# EAGLE design 0.2 (EAGLE 6.4)
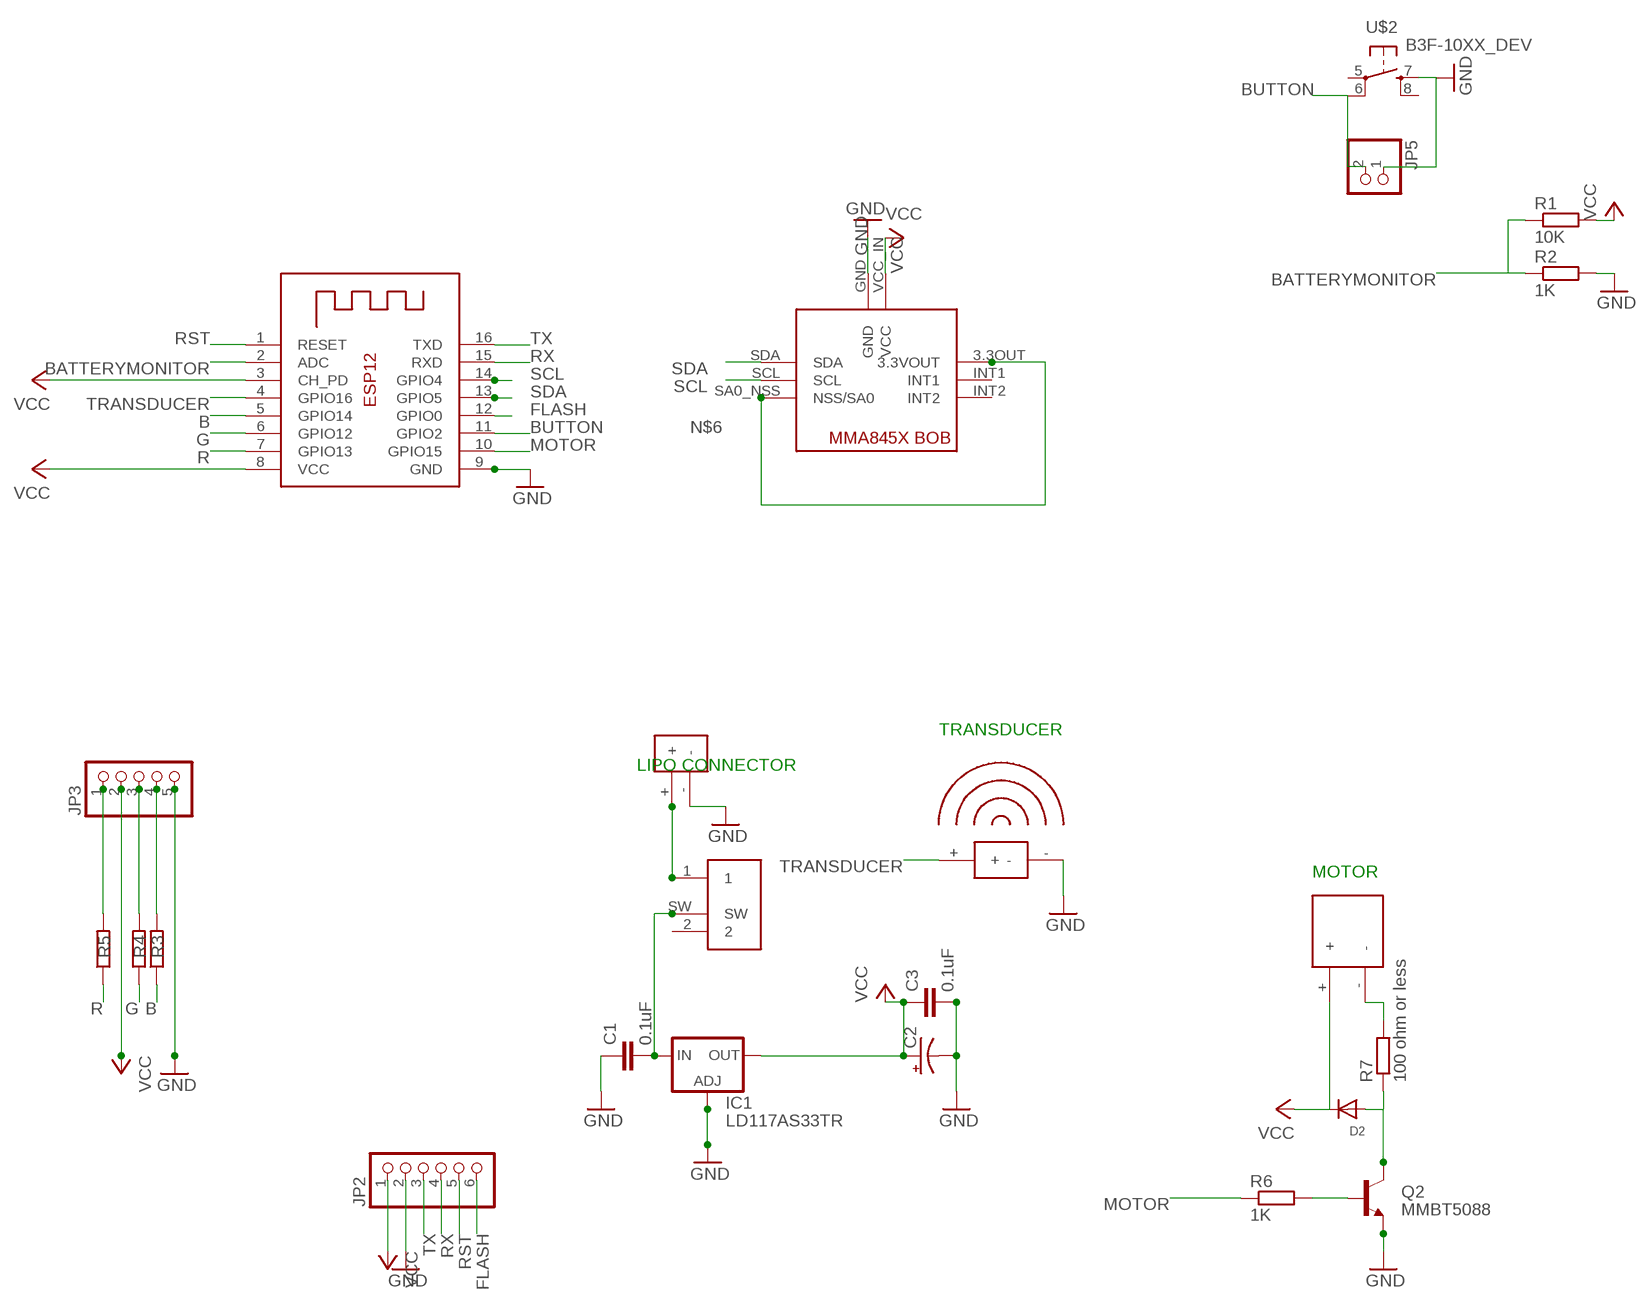
[diagram p0: schematic, sheet 1]

## Parts
C1  0.1uF  CAP0805  [0805]
C2  100UF-25V-20%(PTH)  [CPOL-RADIAL-100UF-25V]
C3  0.1uF  CAP0805  [0805]
D2  DIODE_SOD-123FL  [SOD-123FL]
IC1  LD117AS33TR  [SOT223]
JP2  PINHD-1X6  [1X06]
JP3  PINHD-1X5  [1X05]
JP5  PINHD-1X2/90  [1X02/90]
Q2  MMBT5088  TRANSISTOR_NPNMMBT5088  [SOT23-3]
R1  10K  R-EU_R0805  [R0805]
R2  1K  R-EU_R0805  [R0805]
R3  1K  R-EU_R0805  [R0805]
R4  1K  R-EU_R0805  [R0805]
R5  1K  R-EU_R0805  [R0805]
R6  1K  R-EU_R0805  [R0805]
R7  100 ohm or less  R-EU_R0805  [R0805]
U$1  MMA845X_BREAKOUT  [MMA845XBOB]
U$2  B3F-10XX_DEV  [B3F-10XX]
U$8  TRANSDUCER  [BMT1205XH7.5]
U$11  MICROSWITCH  [MICR_SCHIEBESCHALTER_CHINA_PAC]
U$12  VIBROMOTOR  [VIBRO]
U$13  LIPO  [LIPOCON]
X2  ESP-12  [ESP-12]

## Nets
B: R3.1 X2.5(GPIO14)
BATTERYMONITOR: R1.1 R2.1 X2.2(ADC)
BUTTON: JP5.2 U$2.6(P1) X2.11(GPIO2)
FLASH: JP2.6 X2.12(GPIO0)
G: R4.1 X2.6(GPIO12)
GND: C1.1 C2.2(-) C3.2 IC1.1(ADJ) JP2.2 JP3.5 JP5.1 Q2.2(E) R2.2 U$1.GND U$2.7(S) U$8.- U$13.- X2.9(GND)
MOTOR: R6.1 X2.10(GPIO15)
N$1: R7.2 U$12.-
N$2: U$11.1 U$13.+
N$3: D2.A Q2.3(C) R7.1
N$4: Q2.1(B) R6.2
N$5: C1.2 IC1.3(IN) U$11.SW
N$6: U$1.3.3OUT(3.3VOUT) U$1.SA0_NSS(NSS/SA0)
R: R5.1 X2.7(GPIO13)
RST: JP2.5 X2.1(RESET)
RX: JP2.4 X2.15(RXD)
SCL: U$1.SCL X2.14(GPIO4)
SDA: U$1.SDA X2.13(GPIO5)
TRANSDUCER: U$8.+ X2.4(GPIO16)
TX: JP2.3 X2.16(TXD)
VCC: C2.1(+) C3.1 D2.C IC1.4(OUT) JP2.1 JP3.2 R1.2 U$1.VCC_IN(VCC) U$12.+ X2.3(CH_PD) X2.8(VCC)
XX: JP3.1 R5.2
XXX: JP3.3 R4.2
XXXX: JP3.4 R3.2
Unconnected: U$1.INT1 U$1.INT2 U$2.5(P) U$2.8(S1) U$11.2

## Notes on the sheet
- TRANSDUCER
- LIPO CONNECTOR
- MOTOR

## Library data of the parts
C1 C3 = SparkFun-Passives:CAP: Capacitor Standard 0603 ceramic capacitor, and 0.1" leaded capacitor.
C2 = SparkFun-Capacitors:100UF-25V-20%(PTH): CAP-08439; PROD_ID: CAP-08439
D2 = adafruit:DIODE: Diode SMADIODE - SMA Surface Mount Package 20V 1A Schottky Diode Digikey: 641-1014-6-ND DO-1N4148 - Through Hole Small Current Diode SOD-123 20V 1 A (.5mV Vf) Schottky Diode - Digikey: MBRX120TPMSCT-ND SOD-323 10V 570mA (.38mV Vf, 3ns) Schottky Diode - Digikey: ZLLS410CT-ND SOD-523 30V 30mA Schottky Diode (RB751S-40TE61) - Digikey: RB751S-40TE61CT-ND SOT23-R/W - SOT23 Package (R = Solder Paste/Reflow Ovens, W = Hand-Soldering) BAT54Film 40V 300mA - Digikey: 497-7162-1-ND
IC1 = v-reg:LD117A?*: Low drop fixed and adjustable positive voltage regulators 1 A Source: http://www.st.com/stonline/products/literature/ds/7194/ld1117axx.pdf
JP2 = pinhead:PINHD-1X6: PIN HEADER
JP3 = pinhead:PINHD-1X5: PIN HEADER
JP5 = pinhead:PINHD-1X2: PIN HEADER
Q2 = SparkFun-DiscreteSemi:TRANSISTOR_NPN: Generic NPN BJT MMBT2222A - TRANS-08049 (SOT-23, 1A 40V) MPSA42 - TRANS-09116 (SOT-23, 500mA 300V) MMBT5088LT1G - TRANS-11160 (SOT-23, 50 mA 30V) BC547 - COM-08928 <http://www.sparkfun.com/products/8928> (TO-92 45V 100mA) (1.Collector 2.Base 3.Emitter) 2N3904 - COM-00521 <http://www.sparkfun.com/products/521> (TO-92 40V 200mA) (1.Emitter 2.Base 3.Collector) P2N2222A - COM-12852 <http://www.sparkfun.com/products/12852> (TO-92 40V 600mA) (1.Collector 2.Base 3.Emitter); PROD_ID: TRANS-11160
R1-R7 = resistor:R-EU_: RESISTOR, European symbol
U$1 = roust:MMA845X_BREAKOUT
U$2 = timemachine:B3F-10XX_DEV
U$8 = ghoust:TRANSDUCER
U$11 = roust:MICROSWITCH
U$12 = ghoust:VIBROMOTOR
U$13 = roust:LIPO
X2 = adafruit:ESP-12

## Board
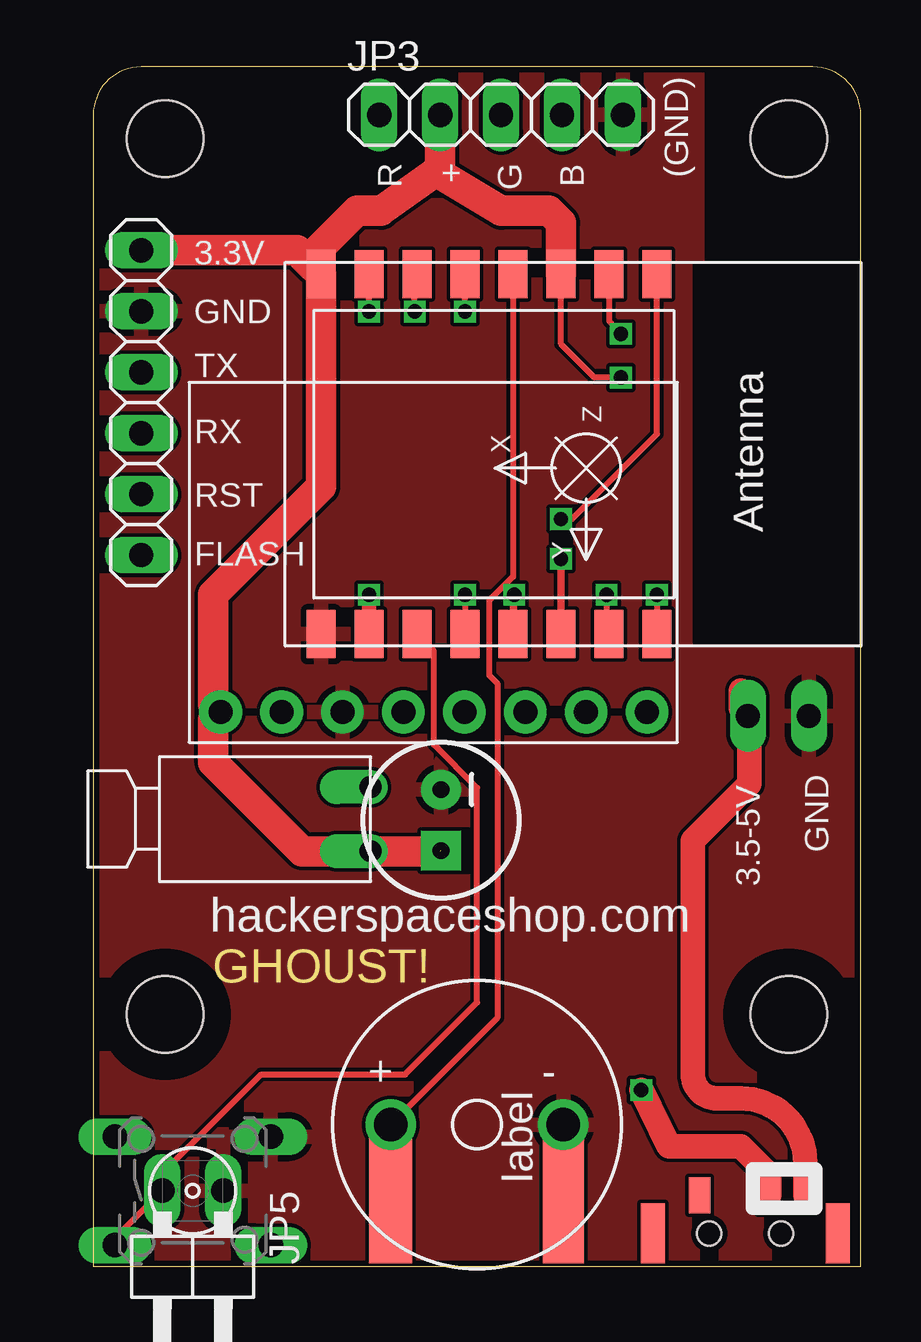
[diagram p1: board, top side]
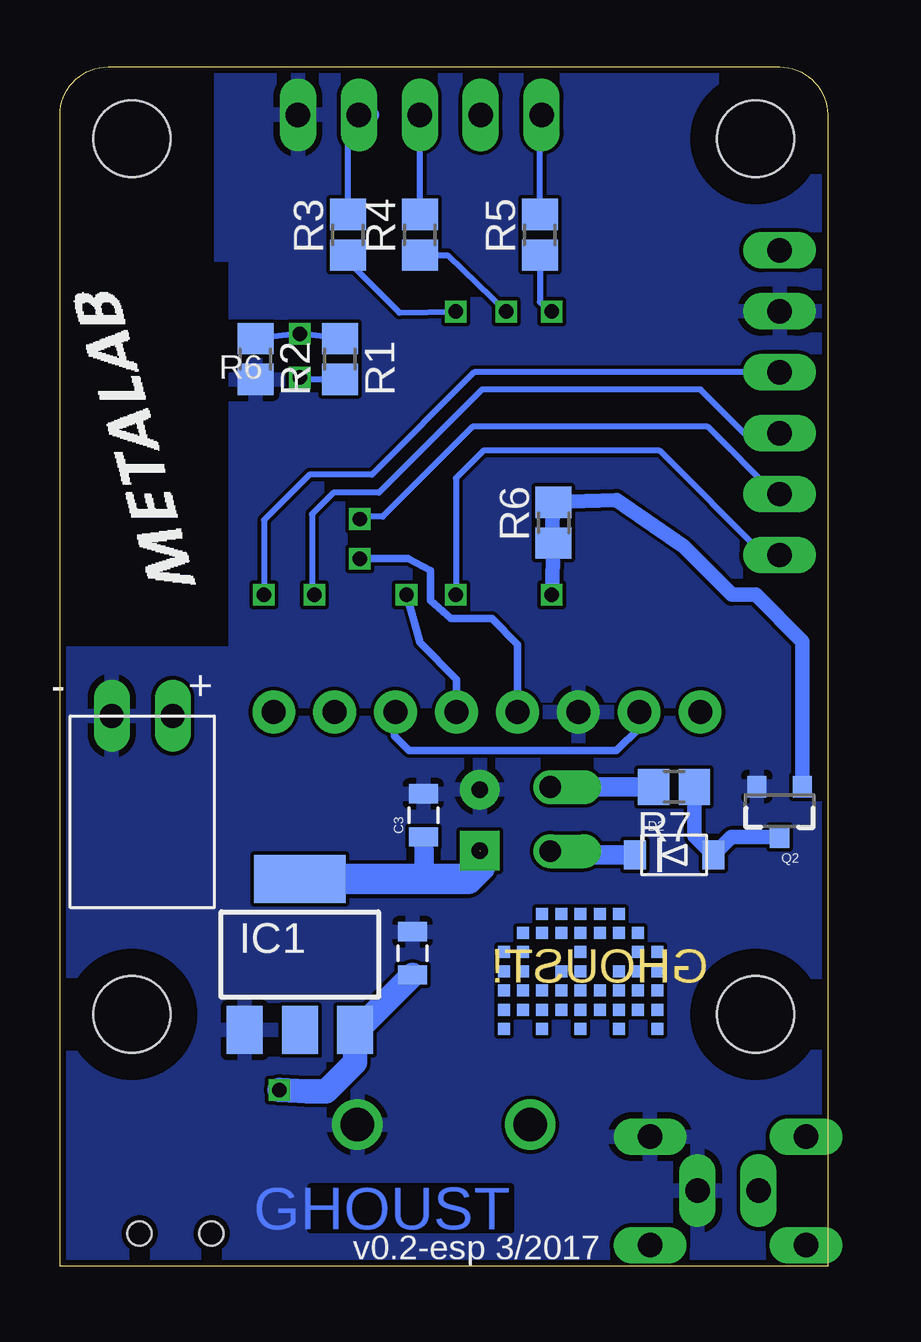
[diagram p2: board, bottom side, seen from below]

Size 32 x 50 mm. Coordinates in mm from the lower left corner, seen from the top.
Outline: 0,0 32,0 32,48 arc90 30,50 2,50 arc90 0,48 0,0
Copper layers (1*16): Top 0.035mm / dielectric 1.5mm / Bottom 0.035mm
Design rules "Fusion_eagle_rule_v1.1": minimum track width 6mil, minimum drill 12mil, track to track 6mil, track to pad 6mil, pad to pad 6mil, via to via 6mil, smd to smd 0mil, copper to edge 10mil, drill to drill 10mil, minimum pad ring 10mil, minimum via ring 6mil, stop-mask expansion 2mil, vias tented up to drill 100mil, thermal gap 10mil
Holes 3.2 mm at 3,10.5 29,10.5 29,47 3,47
tRestrict: area 0.4,7.9 to 5.6,13.1; area 26.4,7.9 to 31.6,13.1; area 26.4,44.4 to 31.6,49.6; area 0.4,44.4 to 5.6,49.6; area 25.5,26 to 34,50.7
bRestrict: area 0.4,7.9 to 5.6,13.1; area 26.4,7.9 to 31.6,13.1; area 26.4,44.4 to 31.6,49.6; area 0.4,44.4 to 5.6,49.6; area 25.6,26 to 34,50.7

### Footprints (pad centres in the part's own frame; a part is rotated, then mirrored left to right if it is on the bottom)
0805 = smd 0.8 x 1.2: 1 -0.9,0; 2 0.9,0
CPOL-RADIAL-100UF-25V = drill 0.7 pad 1.651 square: 1 1.27,0 | drill 0.7 pad 1.651: 2 -1.27,0
SOD-123FL = smd 0.91 x 1.22: A 1.637,0; C -1.637,0
SOT223 = smd 1.5 x 2: 1 -2.3,-3.15; 2 0,-3.15; 3 2.3,-3.15 | smd 3.8 x 2: 4 0,3.15
1X06 = drill 1.016 long: 1 -6.35,0; 2 -3.81,0; 3 -1.27,0; 4 1.27,0; 5 3.81,0; 6 6.35,0
1X05 = drill 1.016 long: 1 -5.08,0; 2 -2.54,0; 3 0,0; 4 2.54,0; 5 5.08,0
1X02/90 = drill 1.016 long: 1 -1.27,-3.81; 2 1.27,-3.81
SOT23-3 = smd 0.8 x 0.9: 1 -0.95,-1; 2 0.95,-1; 3 0,1.1
R0805 = smd 1.3 x 1.5: 1 -0.85,0; 2 0.85,0
MMA845XBOB = drill 1 pad 1.778: 3.3OUT 1.27,16.51; GND 1.27,13.97; INT1 1.27,1.27; INT2 1.27,3.81; SA0_NSS 1.27,6.35; SCL 1.27,11.43; SDA 1.27,8.89; VCC_IN 1.27,19.05
B3F-10XX = drill 1.016 long: 5 -3.251,2.261; 6 -3.251,-2.261; 7 3.251,2.261; 8 3.251,-2.261
GHOUST_LOGO = smd 0.5 x 0.5: P$1 0,0; P$2 -0.8,0; P$3 0.8,0; P$4 -1.6,0; P$5 1.6,0; P$6 -2.4,-0.8; P$7 -1.6,-0.8; P$8 -0.8,-0.8; P$9 0,-0.8; P$10 0.8,-0.8; P$11 1.6,-0.8; P$12 2.4,-0.8; P$13 -3.2,-1.6; P$14 -2.4,-1.6; P$15 3.2,-1.6; P$16 2.4,-1.6; P$17 0,-1.6; P$18 -3.2,-2.4; P$19 -2.4,-2.4; P$20 -0.8,-2.4; P$21 0,-2.4; P$22 1.6,-2.4; P$23 2.4,-2.4; P$24 3.2,-2.4; P$25 -3.2,-3.2; P$26 -2.4,-3.2; P$27 -0.8,-3.2; P$28 -1.6,-3.2; P$29 0,-3.2; P$30 0.8,-3.2; P$31 2.4,-3.2; P$32 1.6,-3.2; P$33 3.2,-3.2; P$34 -3.2,-4; P$35 -1.6,-4; P$36 0,-4; P$37 1.6,-4; P$38 2.4,-4; P$39 3.2,-4; P$40 0.8,-4; P$41 -0.8,-4; P$42 -2.4,-4; P$43 -3.2,-4.8; P$44 -1.6,-4.8; P$45 0,-4.8; P$46 1.6,-4.8; P$47 3.2,-4.8
BMT1205XH7.5 = drill 1.4: + -3.6,0; - 3.6,0 | smd 1.8 x 6: +_PAD -3.6,-2.77 | smd 1.7 x 6: _-PAD 3.6,-2.77
MICR_SCHIEBESCHALTER_CHINA_PAC = smd 0.9 x 1.5: 1 2.5,1.6; 2 -1.9,1.6; SW 1,1.6 | smd 1 x 2.5: GND1 -3.85,0; GND2 3.85,0 | hole 1: -1.5,0; 1.5,0
VIBRO = drill 0.9 pad 1.2 offset: + -1.34,0; - 1.34,0
LIPOCON = drill 1 long: + -1.27,0; - 1.27,0
ESP-12 = smd 2 x 1.2: 1 -7.5,4.5; 2 -7.5,2.5; 3 -7.5,0.5; 4 -7.5,-1.5; 5 -7.5,-3.5; 6 -7.5,-5.5; 7 -7.5,-7.5; 8 -7.5,-9.5; 9 7.5,-9.5; 10 7.5,-7.5; 11 7.5,-5.5; 12 7.5,-3.5; 13 7.5,-1.5; 14 7.5,0.5; 15 7.5,2.5; 16 7.5,4.5

### Placement (x,y rotation side)
C1  17.3,13.05 270 bottom
C2  14.5,18.6 270 top
C3  16.85,18.8 90 bottom
D2  6.4,17.15 0 bottom
IC1  22,13 0 bottom
JP2  2,36 270 top
JP3  17,48 0 top
JP5  4.15,-0.65 180 top
Q2  2,19 180 bottom
R1  20.32,37.82 270 bottom
R2  23.85,37.82 270 bottom
R3  20,43 90 bottom
R4  17,43 90 bottom
R5  12,43 90 bottom
R6  11.42,31 90 bottom
R7  6.4,19.99 180 bottom
U$1  24.36,21.84 90 top
U$2  4.15,3.15 0 top
U$4  [METALAB]  26.01,27.88 90 bottom
U$6  GHOUT_LOGO  [GHOUST_LOGO]  10.3,14.7 0 bottom
U$8  16,5.91 0 top
U$11  27.18,1.37 0 top
U$12  11.56,18.64 90 top
U$13  28.57,22.95 180 bottom
X2  19,33.85 270 top

### Tracks (layer width: path | path; a pad name or v marks a point on that pad's centre or on a via)
B  (via drill 0.6)
  Top 0.254: v15.5,39.8 X2.5
  Bottom 0.254: R3.1 20,41.9 17.85,39.75 v15.5,39.8
BATTERYMONITOR  (via drill 0.6)
  Top 0.254: X2.2 21.5,39.42 v22,38.87
  Bottom 0.254: R1.1 v22,38.87 R2.1
BUTTON
  Top 0.254: U$2.6 0.9,1.18 JP5.2 2.88,3.88 7,8 13,8 16,11 16,19.95 14.2,21.75 14.2,25.65 X2.11
FLASH  (via drill 0.6)
  Top 0.254: v15.5,28 X2.12
  Bottom 0.254: JP2.6 2.65,29.65 7,34 14.35,34 15.5,32.85 v15.5,28
G  (via drill 0.6)
  Top 0.254: v13.4,39.8 13.4,41.25 X2.6
  Bottom 0.254: R4.1 15.85,42.15 v13.4,39.8
GND
  Bottom 0.61: JP3.5 22,48
  pour Top: -1,51 34,51 34,-2 -1,-2
  pour Bottom: -1,51 34,51 34,-2 -1,-2
MOTOR  (via drill 0.6)
  Top 0.61: v11.5,28 X2.10
  Bottom 0.61: R6.1 v11.5,28
N$1
  Bottom 0.813: U$12.- 7.89,19.98 R7.2
N$2
  Top 1.016: U$11.1 29.68,4.32 arc90 27,7 26,7 arc-90 25,8 25,17.75 27.35,20.1 27.35,23.65 27,24 27,23.25 U$13.+
N$3
  Bottom 0.61: Q2.3 4.01,17.9 D2.A 5.55,17.94 R7.1
N$4
  Bottom 0.61: Q2.1 1.05,26.05 3,28 4,28 6,30 8.8,31.95 R6.2 11.52,30
N$5  (via drill 0.6)
  Top 1.016: U$11.SW 28.18,3.82 27,5 24,5 v22.85,7.35
  Bottom 1.016: v22.85,7.35 21.7,7.3 20.9,7.3 19.7,8.5 IC1.3 19.6,9.85 C1.2
N$6
  Bottom 0.305: U$1.3.3OUT 7.85,22.45 8.8,21.5 17.45,21.5 18.05,22.1 18.05,23.07 U$1.SA0_NSS
R  (via drill 0.6)
  Top 0.254: v11.5,39.8 X2.7
  Bottom 0.254: R5.1 12,40.2 v11.5,39.8
RST  (via drill 0.6)
  Top 0.254: v19.5,31.15 19.95,31.15 23.5,34.7 X2.1
  Bottom 0.254: JP2.5 2.19,32.19 5,35 14.8,35 18.55,31.25 19.7,31.25 v19.5,31.15
RX  (via drill 0.6)
  Top 0.254: v21.4,28 21.4,26.45 X2.15
  Bottom 0.254: JP2.4 3.48,34.73 5.3,36.55 14.4,36.55 18.7,32.25 20.6,32.25 21.5,31.35 21.5,28.1 v21.4,28
SCL  (via drill 0.6)
  Top 0.305: v19.5,29.5 X2.14
  Bottom 0.305: U$1.SCL 12.93,25.93 14,27 15.7,27 16.55,27.75 16.55,29 17.5,29.5 v19.5,29.5
SDA  (via drill 0.6)
  Top 0.305: v17.55,28 X2.13
  Top 0.406: 17.47,26.47 X2.13
  Bottom 0.305: U$1.SDA 15.47,24.47 17,26 v17.55,28
TRANSDUCER
  Top 0.254: X2.4 17.5,28.75 16.5,27.75 16.5,24.65 16.85,24.3 16.85,10.36 U$8.+
TX  (via drill 0.6)
  Top 0.254: v23.5,28 X2.16
  Bottom 0.254: JP2.3 14.73,37.27 19,33 21.6,33 23.5,31.1 v23.5,28
VCC  (via drill 0.6)  (1 unrouted)
  Top 0.254: v22,37.05 20.9,37.05 19.5,38.45 X2.3
  Top 1.27: X2.3 19.5,43.5 19,44 17,44 14.29,45.63 | JP2.1 8.5,42.35 8.93,41.92 | 8.93,41.92 X2.8 9.5,32.5 5,28 5,23.42 U$1.VCC_IN 5,22.8 5,21 8.7,17.3 U$12.+ 14.47,17.3 | 8.93,41.92 11,44 12,44 14.29,45.63 | JP3.2 14.45,45.75 14.29,45.63
  Bottom 0.254: R1.2 21.97,36.97 v22,37.05
  Bottom 0.813: D2.C 11.41,17.15 U$12.+ | C3.1 16.8,16.15
  Bottom 1.27: IC1.4 16.8,16.15 15,16.15 14.5,16.65 C2.1
XX
  Bottom 0.254: R5.2 12,47.81
  Bottom 0.61: JP3.1 12,47.81
XXX
  Bottom 0.254: R4.2 17,47.73
  Bottom 0.61: JP3.3 17,47.73
XXXX
  Bottom 0.254: R3.2 20,47.81
  Bottom 0.61: JP3.4 19,48 20,47.81

### Text on the board
Bottom: GHOUST
Dimension: GHOUST!
tPlace: hackerspaceshop.com
bPlace: v0.2-esp 3/2017
tOrigins: OFF | ON
tNames: (GND) | R | + | G | B | 3.3V | GND | TX | RX | RST | FLASH | GND | 3.5-5V
bNames: R6
bStop: GHOUST